# EAGLE design 2mbsimm_dip (EAGLE 8.0.1)
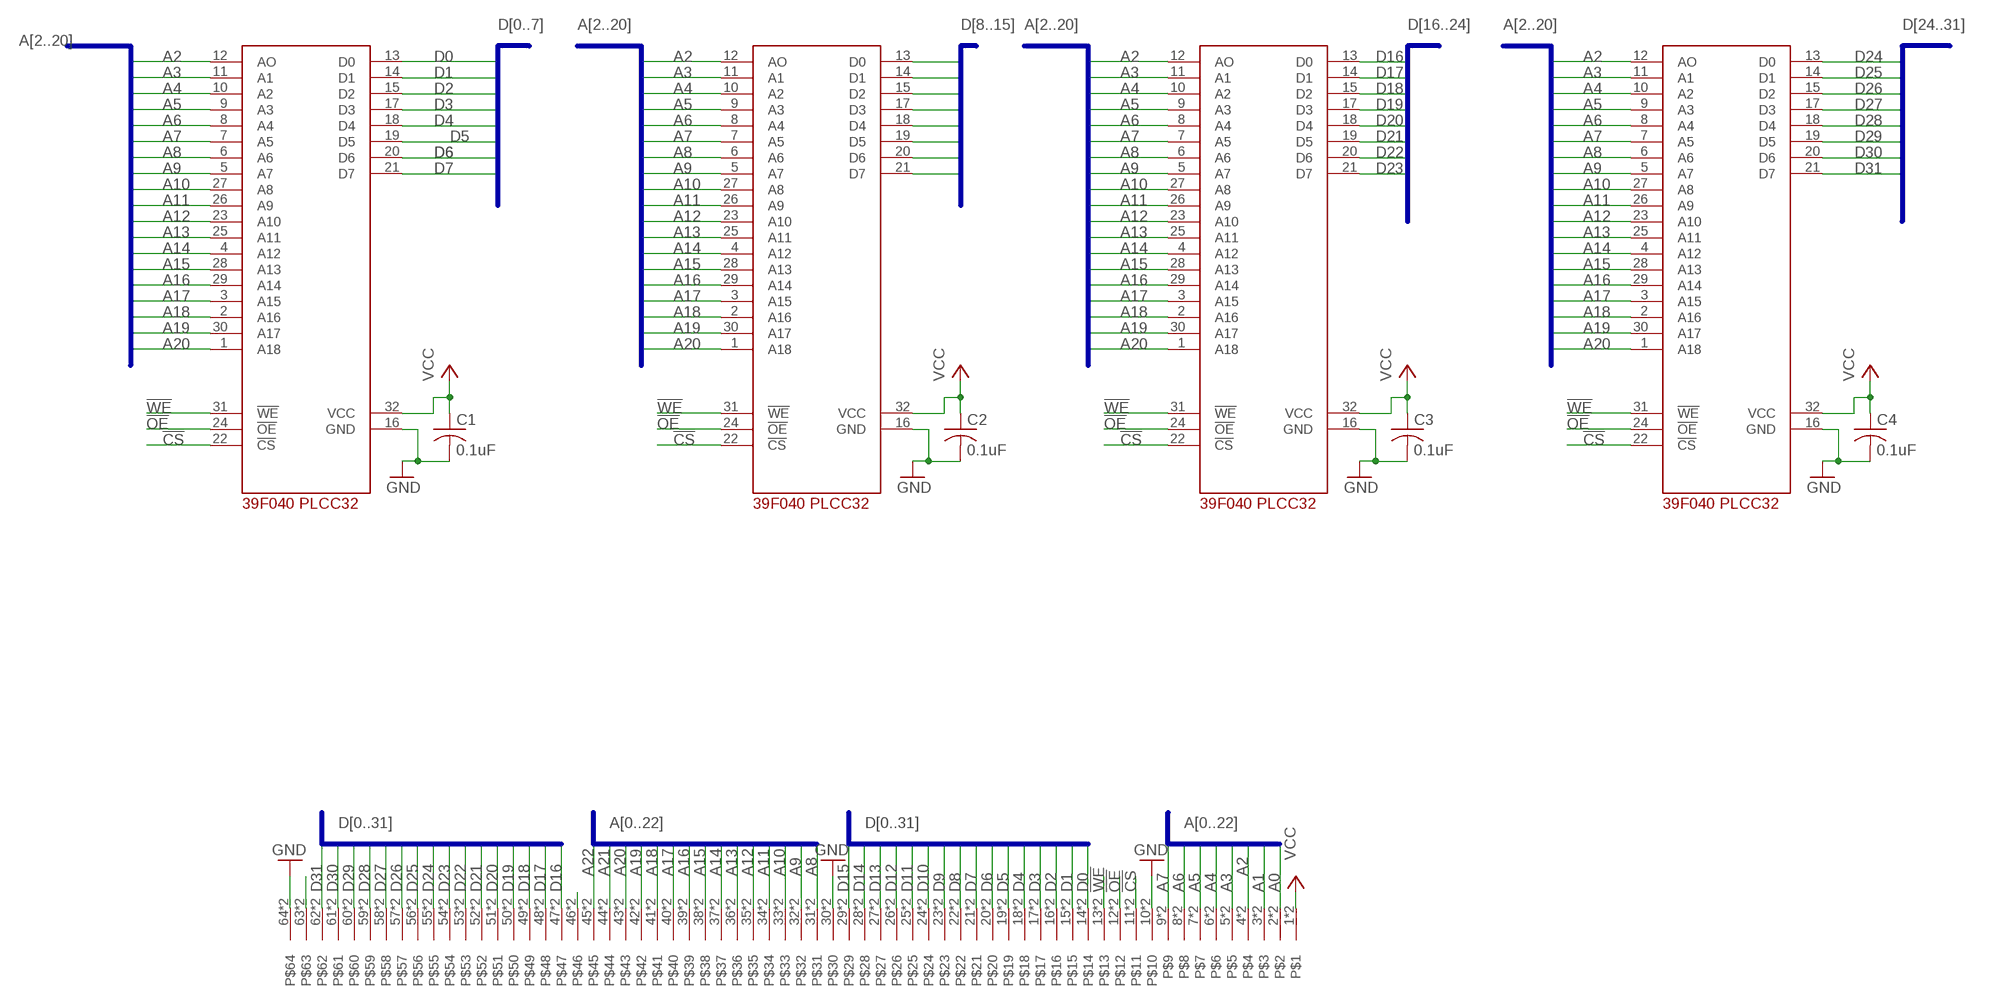
[diagram p0: schematic, sheet 1]

## Parts
C1  0.1uF  C-USC1206  [C1206]
C2  0.1uF  C-USC1206  [C1206]
C3  0.1uF  C-USC1206  [C1206]
C4  0.1uF  C-USC1206  [C1206]
CON1  MYSIMM  [SIMM64L]
U$1  39F040-PLCC-SOCKET-DIP  [S32]
U$2  39F040-PLCC-SOCKET-DIP  [S32]
U$3  39F040-PLCC-SOCKET-DIP  [S32]
U$4  39F040-PLCC-SOCKET-DIP  [S32]

## Nets
!CS: CON1.11 CON1.75 U$1.22(!CS) U$2.22(!CS) U$3.22(!CS) U$4.22(!CS)
!OE: CON1.12 CON1.76 U$1.24(!OE) U$2.24(!OE) U$3.24(!OE) U$4.24(!OE)
!WE: CON1.13 CON1.77 U$1.31(!WE) U$2.31(!WE) U$3.31(!WE) U$4.31(!WE)
A0: CON1.2 CON1.66
A1: CON1.3 CON1.67
A2: CON1.4 CON1.68 U$1.12(AO) U$2.12(AO) U$3.12(AO) U$4.12(AO)
A3: CON1.5 CON1.69 U$1.11(A1) U$2.11(A1) U$3.11(A1) U$4.11(A1)
A4: CON1.6 CON1.70 U$1.10(A2) U$2.10(A2) U$3.10(A2) U$4.10(A2)
A5: CON1.7 CON1.71 U$1.9(A3) U$2.9(A3) U$3.9(A3) U$4.9(A3)
A6: CON1.8 CON1.72 U$1.8(A4) U$2.8(A4) U$3.8(A4) U$4.8(A4)
A7: CON1.9 CON1.73 U$1.7(A5) U$2.7(A5) U$3.7(A5) U$4.7(A5)
A8: CON1.31 CON1.95 U$1.6(A6) U$2.6(A6) U$3.6(A6) U$4.6(A6)
A9: CON1.32 CON1.96 U$1.5(A7) U$2.5(A7) U$3.5(A7) U$4.5(A7)
A10: CON1.33 CON1.97 U$1.27(A8) U$2.27(A8) U$3.27(A8) U$4.27(A8)
A11: CON1.34 CON1.98 U$1.26(A9) U$2.26(A9) U$3.26(A9) U$4.26(A9)
A12: CON1.35 CON1.99 U$1.23(A10) U$2.23(A10) U$3.23(A10) U$4.23(A10)
A13: CON1.36 CON1.100 U$1.25(A11) U$2.25(A11) U$3.25(A11) U$4.25(A11)
A14: CON1.37 CON1.101 U$1.4(A12) U$2.4(A12) U$3.4(A12) U$4.4(A12)
A15: CON1.38 CON1.102 U$1.28(A13) U$2.28(A13) U$3.28(A13) U$4.28(A13)
A16: CON1.39 CON1.103 U$1.29(A14) U$2.29(A14) U$3.29(A14) U$4.29(A14)
A17: CON1.40 CON1.104 U$1.3(A15) U$2.3(A15) U$3.3(A15) U$4.3(A15)
A18: CON1.41 CON1.105 U$1.2(A16) U$2.2(A16) U$3.2(A16) U$4.2(A16)
A19: CON1.42 CON1.106 U$1.30(A17) U$2.30(A17) U$3.30(A17) U$4.30(A17)
A20: CON1.43 CON1.107 U$1.1(A18) U$2.1(A18) U$3.1(A18) U$4.1(A18)
A21: CON1.44 CON1.108
A22: CON1.45 CON1.109
D0: CON1.14 CON1.78 U$1.13(D0)
D1: CON1.15 CON1.79 U$1.14(D1)
D2: CON1.16 CON1.80 U$1.15(D2)
D3: CON1.17 CON1.81 U$1.17(D3)
D4: CON1.18 CON1.82 U$1.18(D4)
D5: CON1.19 CON1.83 U$1.19(D5)
D6: CON1.20 CON1.84 U$1.20(D6)
D7: CON1.21 CON1.85 U$1.21(D7)
D8: CON1.22 CON1.86 U$2.13(D0)
D9: CON1.23 CON1.87 U$2.14(D1)
D10: CON1.24 CON1.88 U$2.15(D2)
D11: CON1.25 CON1.89 U$2.17(D3)
D12: CON1.26 CON1.90 U$2.18(D4)
D13: CON1.27 CON1.91 U$2.19(D5)
D14: CON1.28 CON1.92 U$2.20(D6)
D15: CON1.29 CON1.93 U$2.21(D7)
D16: CON1.47 CON1.111 U$3.13(D0)
D17: CON1.48 CON1.112 U$3.14(D1)
D18: CON1.49 CON1.113 U$3.15(D2)
D19: CON1.50 CON1.114 U$3.17(D3)
D20: CON1.51 CON1.115 U$3.18(D4)
D21: CON1.52 CON1.116 U$3.19(D5)
D22: CON1.53 CON1.117 U$3.20(D6)
D23: CON1.54 CON1.118 U$3.21(D7)
D24: CON1.55 CON1.119 U$4.13(D0)
D25: CON1.56 CON1.120 U$4.14(D1)
D26: CON1.57 CON1.121 U$4.15(D2)
D27: CON1.58 CON1.122 U$4.17(D3)
D28: CON1.59 CON1.123 U$4.18(D4)
D29: CON1.60 CON1.124 U$4.19(D5)
D30: CON1.61 CON1.125 U$4.20(D6)
D31: CON1.62 CON1.126 U$4.21(D7)
GND [thicker]: C1.2 C2.2 C3.2 C4.2 CON1.10 CON1.30 CON1.64 CON1.74 CON1.94 CON1.128 U$1.16(GND) U$2.16(GND) U$3.16(GND) U$4.16(GND)
N$1 [thicker]: CON1.46 CON1.110
UNUSED3: CON1.63 CON1.127
VCC [thicker]: C1.1 C2.1 C3.1 C4.1 CON1.1 CON1.65 U$1.32(VCC) U$2.32(VCC) U$3.32(VCC) U$4.32(VCC)

## Buses
A[0..22]
D[0..31]
A[2..20]
D[0..7]
D[8..15]
D[16..24]
D[24..31]

## Library data of the parts
C1-C4 = resistor:C-US: CAPACITOR, American symbol
CON1 = Doug:MYSIMM: 64-Pin SIMM
U$1-U$4 = capstuff:39F040-PLCC-SOCKET-DIP: 4MB Flash in Plcc socket

## Net classes
0 default: width 0.178 mm, drill 0.305 mm, clearance 0.178 mm
1 thicker: width 0.305 mm, drill 0.305 mm, clearance 0.178 mm

## Board
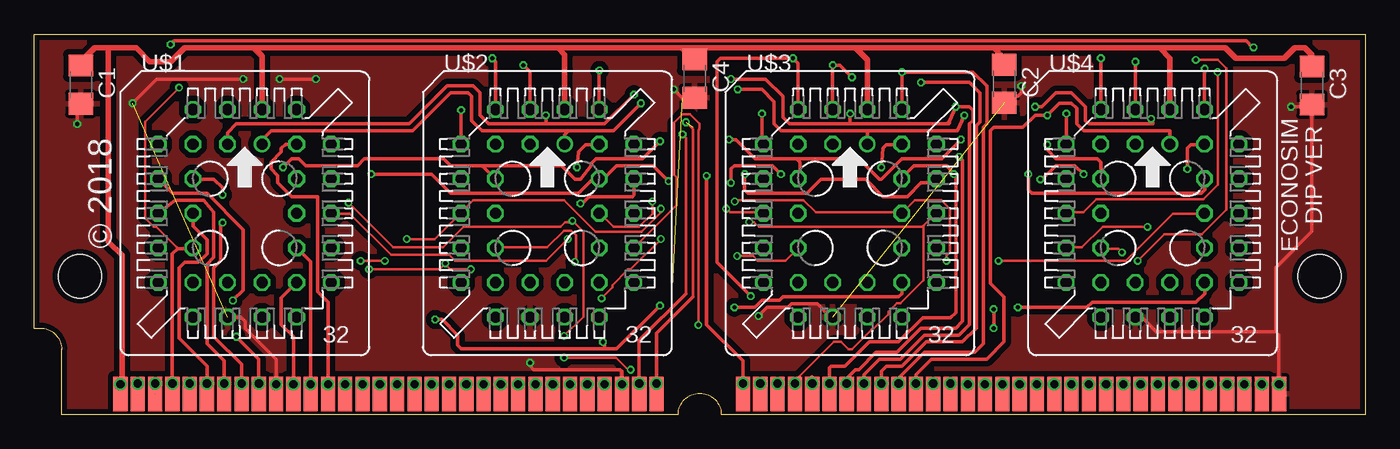
[diagram p1: board, top side]
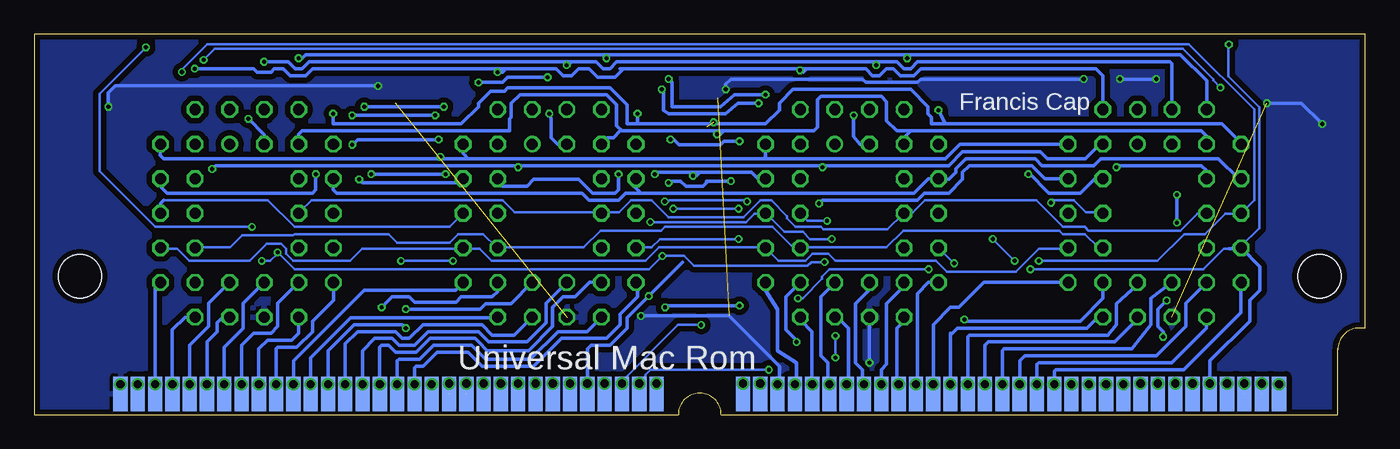
[diagram p2: board, bottom side, seen from below]

Size 97.79 x 27.94 mm. Coordinates in mm from the lower left corner, seen from the top.
Copper layers (1*16): Top 0.035559375mm / dielectric 1.6mm / Bottom 0.035559375mm
Design rules "oshpark-2layer": minimum track width 6mil, minimum drill 10mil, track to track 6mil, track to pad 6mil, pad to pad 6mil, via to via 6mil, smd to smd 6mil, copper to edge 15mil, drill to drill 6mil, minimum pad ring 5mil, minimum via ring 5mil, stop-mask expansion 2.5mil, vias tented up to drill 0mil, thermal gap 10mil

### Footprints (pad centres in the part's own frame; a part is rotated, then mirrored left to right if it is on the bottom)
C1206 = smd 1.6 x 1.8: 1 -1.4,0; 2 1.4,0
SIMM64L = smd 1.041 x 2.54: 1 -42.545,-8.636; 2 -41.275,-8.636; 3 -40.005,-8.636; 4 -38.735,-8.636; 5 -37.465,-8.636; 6 -36.195,-8.636; 7 -34.925,-8.636; 8 -33.655,-8.636; 9 -32.385,-8.636; 10 -31.115,-8.636; 11 -29.845,-8.636; 12 -28.575,-8.636; 13 -27.305,-8.636; 14 -26.035,-8.636; 15 -24.765,-8.636; 16 -23.495,-8.636; 17 -22.225,-8.636; 18 -20.955,-8.636; 19 -19.685,-8.636; 20 -18.415,-8.636; 21 -17.145,-8.636; 22 -15.875,-8.636; 23 -14.605,-8.636; 24 -13.335,-8.636; 25 -12.065,-8.636; 26 -10.795,-8.636; 27 -9.525,-8.636; 28 -8.255,-8.636; 29 -6.985,-8.636; 30 -5.715,-8.636; 31 -4.445,-8.636; 32 -3.175,-8.636; 33 3.175,-8.636; 34 4.445,-8.636; 35 5.715,-8.636; 36 6.985,-8.636; 37 8.255,-8.636; 38 9.525,-8.636; 39 10.795,-8.636; 40 12.065,-8.636; 41 13.335,-8.636; 42 14.605,-8.636; 43 15.875,-8.636; 44 17.145,-8.636; 45 18.415,-8.636; 46 19.685,-8.636; 47 20.955,-8.636; 48 22.225,-8.636; 49 23.495,-8.636; 50 24.765,-8.636; 51 26.035,-8.636; 52 27.305,-8.636; 53 28.575,-8.636; 54 29.845,-8.636; 55 31.115,-8.636; 56 32.385,-8.636; 57 33.655,-8.636; 58 34.925,-8.636; 59 36.195,-8.636; 60 37.465,-8.636; 61 38.735,-8.636; 62 40.005,-8.636; 63 41.275,-8.636; 64 42.545,-8.636 | smd 1.041 x 2.54 bottom: 65 -42.545,-8.636; 66 -41.275,-8.636; 67 -40.005,-8.636; 68 -38.735,-8.636; 69 -37.465,-8.636; 70 -36.195,-8.636; 71 -34.925,-8.636; 72 -33.655,-8.636; 73 -32.385,-8.636; 74 -31.115,-8.636; 75 -29.845,-8.636; 76 -28.575,-8.636; 77 -27.305,-8.636; 78 -26.035,-8.636; 79 -24.765,-8.636; 80 -23.495,-8.636; 81 -22.225,-8.636; 82 -20.955,-8.636; 83 -19.685,-8.636; 84 -18.415,-8.636; 85 -17.145,-8.636; 86 -15.875,-8.636; 87 -14.605,-8.636; 88 -13.335,-8.636; 89 -12.065,-8.636; 90 -10.795,-8.636; 91 -9.525,-8.636; 92 -8.255,-8.636; 93 -6.985,-8.636; 94 -5.715,-8.636; 95 -4.445,-8.636; 96 -3.175,-8.636; 97 3.175,-8.636; 98 4.445,-8.636; 99 5.715,-8.636; 100 6.985,-8.636; 101 8.255,-8.636; 102 9.525,-8.636; 103 10.795,-8.636; 104 12.065,-8.636; 105 13.335,-8.636; 106 14.605,-8.636; 107 15.875,-8.636; 108 17.145,-8.636; 109 18.415,-8.636; 110 19.685,-8.636; 111 20.955,-8.636; 112 22.225,-8.636; 113 23.495,-8.636; 114 24.765,-8.636; 115 26.035,-8.636; 116 27.305,-8.636; 117 28.575,-8.636; 118 29.845,-8.636; 119 31.115,-8.636; 120 32.385,-8.636; 121 33.655,-8.636; 122 34.925,-8.636; 123 36.195,-8.636; 124 37.465,-8.636; 125 38.735,-8.636; 126 40.005,-8.636; 127 41.275,-8.636; 128 42.545,-8.636 | hole 3.175: 45.517,0; -45.517,0
S32 = drill 0.813: 1 1.27,5.08 | drill 0.813 octagon: 2 -1.27,7.62; 3 -1.27,5.08; 4 -3.81,7.62; 5 -6.35,5.08; 6 -3.81,5.08; 7 -6.35,2.54; 8 -3.81,2.54; 9 -6.35,0; 10 -3.81,0; 11 -6.35,-2.54; 12 -3.81,-2.54; 13 -6.35,-5.08; 14 -3.81,-7.62; 15 -3.81,-5.08; 16 -1.27,-7.62; 17 -1.27,-5.08; 18 1.27,-7.62; 19 1.27,-5.08; 20 3.81,-7.62; 21 6.35,-5.08; 22 3.81,-5.08; 23 6.35,-2.54; 24 3.81,-2.54; 25 6.35,0; 26 3.81,0; 27 6.35,2.54; 28 3.81,2.54; 29 6.35,5.08; 30 3.81,7.62; 31 3.81,5.08; 32 1.27,7.62

### Placement (x,y rotation side)
C1  3.44,24.23 270 top
C2  71.25,24.29 270 top
C3  93.86,24.16 270 top
C4  48.52,24.67 270 top
CON1  48.9,10.16 0 top
U$1  15.48,14.78 0 top
U$2  37.7,14.78 0 top
U$3  59.93,14.78 0 top
U$4  82.15,14.78 0 top

### Tracks (layer width: path | path; a pad name or v marks a point on that pad's centre or on a via)
!CS  (via drill 0.3 pad 0.25, 0.6)
  Top 0.254: CON1.75 19.05,5.71 18.16,6.6 18.16,8.57 U$1.22 | v29.46,6.99 29.97,6.99 31.12,5.84 31.12,5.08 31.37,4.83 41.91,4.83 | 41.91,4.83 41.91,5.21 v41.78,5.33 | 41.91,4.83 42.8,4.83 v45.97,8 | v51.44,7.87 52.96,7.87 53.47,8.38 54.74,8.38 54.99,8.64 63.5,8.64 63.75,8.89 63.75,9.68 U$3.22 | v72.26,7.87 77.34,7.87 77.72,8.26 85.34,8.26 85.98,8.89 85.98,9.68 U$4.22
  Top 0.406: v19.05,2.22 CON1.75
  Bottom 0.254: U$1.22 19.29,8.53 20.96,6.86 29.34,6.86 v29.46,6.99 | v41.78,5.33 41.78,5.46 42.55,6.22 42.55,8.67 U$2.22 | v45.97,8 51.31,8 v51.44,7.87 | U$3.22 63.74,9.03 64.13,8.64 66.42,8.64 66.8,8.26 69.85,8.26 70.23,8.64 71.5,8.64 v72.26,7.87
  Bottom 0.305: v19.05,2.22 CON1.75
!OE  (via drill 0.6)
  Top 0.178: 20.16,2.38 v20.32,2.22
  Top 0.254: CON1.76 20.32,11.21 U$1.24
  Top 0.406: v20.32,2.22 CON1.76
  Bottom 0.178: v20.32,2.22 20.32,2.54 | U$1.24 19.37,12.27 19.63,12.27 20.61,13.25 22.21,13.25 22.48,13.51 33.95,13.51 35.19,12.27 41.5,12.27 U$2.24 41.59,12.27 42.04,12.27 43.55,13.78 51.46,13.78 51.73,13.51 56.17,13.51 57.42,12.27 63.73,12.27 U$3.24 63.82,12.27 64.8,13.25 66.66,13.25 67.28,12.62 71.11,12.62 71.73,13.25 78.66,13.25 78.75,13.16 82.49,13.16 83.38,12.27 85.95,12.27 U$4.24
  Bottom 0.305: v20.32,2.22 CON1.76
!WE  (via drill 0.3 pad 0.25, 0.6)
  Top 0.254: CON1.77 21.59,8.26 20.83,9.02 20.83,16 18.92,16 17.91,17.02 17.91,17.53 17.4,18.03 17.4,18.54 18.16,19.3 18.16,19.56 18.46,19.86 U$1.31 | v39.88,18.16 40.01,19.3 40.51,19.81 41.47,19.81 U$2.31 | v62.23,18.16 62.36,19.56 62.61,19.81 63.69,19.81 U$3.31 | v84.71,18.03 84.71,19.56 84.96,19.81 85.91,19.81 U$4.31
  Top 0.406: v21.59,2.22 CON1.77
  Bottom 0.254: v21.59,2.22 21.72,2.35 | U$1.31 19.51,19.86 20.57,18.8 23.37,18.8 23.88,19.3 29.59,19.3 30.61,18.29 39.75,18.29 | 39.75,18.29 v39.88,18.16 | 39.75,18.29 62.1,18.29 | 62.1,18.29 v62.23,18.16 | 62.1,18.29 84.46,18.29 v84.71,18.03
  Bottom 0.305: v21.59,2.22 CON1.77
A0  (1 unrouted)
A1  (1 unrouted)
A2  (via drill 0.3, 0.6 pad 0.25)
  Top 0.178: 11.63,12.19 11.63,12.18 U$1.12 | v39.73,11.2 39.82,11.29 39.82,13.16 39.46,13.51 38.93,13.51 37.68,12.27 33.95,12.27 U$2.12 | v51.64,11.65 52.79,11.65 53.15,11.29 55.19,11.29 56.08,12.18 U$3.12 | v79.91,11.91 79.64,12.18 78.4,12.18 U$4.12 | v10.66,24 8.17,21.51 8.17,14.4 8.79,13.78 8.97,13.78 10.48,12.27 10.54,12.19 | v85.33,26.05 86.93,26.05 87.55,25.43 87.55,15.02 85.78,13.25 83.02,13.25 v81.06,11.29
  Top 0.254: v10.16,2.29 CON1.4 10.16,11.81 10.54,12.19 11.63,12.19 11.81,12.19
  Bottom 0.178: CON1.4 10.21,1.6 10.21,2.22 v10.16,2.29 | v39.73,11.2 40.7,11.2 40.97,10.94 49.33,10.94 50.04,11.65 v51.64,11.65 52.62,10.67 78.66,10.67 v79.91,11.91 79.91,11.82 80.44,11.29 v81.06,11.29 | v10.66,24 11.19,24.54 11.19,24.62 13.41,26.85 84.53,26.85 v85.33,26.05
A3  (via drill 0.3, 0.3 pad 0.25, 0.6 pad 0.25)
  Top 0.178: v24.61,10.67 29.77,10.67 v30.21,11.11 30.21,11.02 30.57,10.67 v32.08,10.67 | v46.04,12.89 43.82,10.67 43.64,10.67 42.48,9.51 42.48,9.34 v41.68,8.53 | v81.78,13.78 78.49,13.78 76.97,12.27 75.82,12.27 U$4.11
  Top 0.254: CON1.69 v11.43,2.29 | v89.57,26.96 89.5,26.96 89.03,27.43 10.29,27.43 v10.03,27.18
  Bottom 0.178: v11.43,2.29 11.46,2.31 CON1.69 | v24.61,10.67 11.9,10.67 10.39,12.18 10.12,12.18 10.03,12.19 | v30.21,11.11 31.28,12.18 U$2.11 | v46.04,12.89 51.82,12.89 52.44,12.27 53.51,12.27 U$3.11 | v41.68,8.53 41.33,8.53 39.9,9.96 39.9,10.13 39.37,10.67 v32.08,10.67 | v81.78,13.78 88.89,13.78 92.98,17.87 92.98,23.56 89.7,26.84 | U$1.11 9.14,12.36 7.81,13.69 7.81,22.58 10.08,24.85 10.08,27.13 v10.03,27.18
  Bottom 0.254: CON1.69 v11.43,2.29 11.43,3.94 8.51,6.86 8.51,8.38 7.75,9.14 7.75,10.86 U$1.11 9.73,12.24 9.78,12.19 10.03,12.19 | 89.7,26.84 v89.57,26.96
A4  (via drill 0.6 pad 0.25)
  Top 0.254: v12.7,2.29 CON1.70 12.7,3.56 10.67,5.59 10.67,10.79 11.05,11.18 12.07,11.18 12.7,11.81 12.7,12.83 11.68,13.84 11.68,14.76 U$1.10
  Bottom 0.178: U$4.10 78.31,14.85 77.42,15.73 63.37,15.73 62.48,14.85 56.17,14.85 U$3.10 56.08,14.85 54.84,14.85 53.95,15.73 52.44,15.73 51.19,14.49 45.68,14.49 44.44,15.73 43.64,15.73 42.48,14.58 42.48,14.4 41.86,13.78 39.99,13.78 39.82,13.6 35.1,13.6 33.95,14.76 U$2.10 33.86,14.85 33.24,14.85 32.35,15.73 24.17,15.73 22.21,13.78 20.61,13.78 20.35,13.51 13.59,13.51 12.34,14.76 11.72,14.76 U$1.10 | v12.7,2.29 CON1.70
A5  (via drill 0.3, 0.6 pad 0.25)
  Top 0.178: v13.97,2.29 14.03,2.31 CON1.71 | v25.77,11.29 v23.99,11.29 | v27.37,12.89 29.41,12.89 31.28,14.76 U$2.9 31.37,14.85 32.26,15.73 38.93,15.73 41.24,13.42 44.62,13.42 46.04,14.85 v46.04,15.11 | v50.84,15.11 51.11,14.85 53.51,14.85 U$3.9 | v86.93,25.16 86.93,16.89 85.87,15.82 78.04,15.82 77.06,14.85 75.82,14.85 U$4.9
  Top 0.254: U$1.9 10.35,15.75 12.45,15.75 13.21,14.86 13.21,11.56 12.7,11.05 12.7,5.21 13.97,3.94 v13.97,2.29 CON1.71
  Bottom 0.178: v23.99,11.29 15.28,11.29 13.32,13.25 11.81,13.25 10.3,14.76 9.14,14.76 U$1.9 9.06,14.85 8.17,15.73 8.17,22.4 12.97,27.2 85.06,27.2 86.93,25.34 v86.93,25.16 | v27.37,12.89 v25.77,11.29 | v46.04,15.11 v50.84,15.11
  Bottom 0.254: v13.97,2.29 CON1.71
A6  (via drill 0.3 pad 0.25, 0.6 pad 0.25)
  Top 0.178: v15.24,2.29 15.28,2.31 CON1.72
  Top 0.254: CON1.72 v15.24,2.29 15.24,3.68 13.21,5.71 13.21,10.79 13.72,11.3 13.72,13.97 v13.84,14.1 | v13.84,16.13 13.84,16.64 13.21,17.27 11.72,17.27 U$1.8 | v18.29,18.16 18.92,18.8 19.43,18.8 19.94,18.29 23.75,18.29 24.26,18.8 30.1,18.8 30.61,18.29 32.93,18.29 | 32.93,18.29 U$2.8 | 32.93,18.29 38.73,18.29 39.75,17.27 40.13,17.27 40.89,18.29 40.89,18.41 41.27,18.8 44.7,18.8 v45.97,20.07 | v51.05,20.19 51.56,20.19 52.96,18.8 56.01,18.8 | 56.01,18.8 56.26,18.54 56.26,17.46 U$3.8 | 56.01,18.8 60.58,18.8 62.1,17.27 62.23,17.27 63.75,18.8 66.68,18.8 v68.07,20.19 | v74.42,19.81 74.42,19.43 75.06,18.8 78.1,18.8 78.36,18.54 78.36,17.34 U$4.8
  Bottom 0.254: v15.24,2.29 CON1.72 | v13.84,14.1 v13.84,16.13 | U$1.8 11.67,17.89 12.07,18.29 18.16,18.29 v18.29,18.16 | v45.97,20.07 47.12,20.07 47.37,19.81 50.42,19.81 50.93,20.32 v51.05,20.19 | v68.07,20.19 74.04,20.19 v74.42,19.81
A7  (via drill 0.3 pad 0.25, 0.6 pad 0.25)
  Top 0.178: v16.51,2.29 16.52,2.31 CON1.73
  Top 0.254: CON1.73 v16.51,2.29 16.51,4.06 v14.86,5.71 | v14.61,8.38 15.37,9.14 15.37,13.59 12.7,16.26 10.19,16.26 U$1.7
  Bottom 0.254: CON1.73 v16.51,2.29 | v14.86,5.71 14.86,6.1 15.24,6.48 15.24,7.75 v14.61,8.38 | U$1.7 9.32,17.32 10.8,18.8 19.43,18.8 19.94,18.29 23.75,18.29 24.26,18.8 29.34,18.8 30.1,18.03 30.1,17.78 30.61,17.27 31.31,17.27 U$2.7 32.08,17.32 33.15,16.26 53.21,16.26 | 53.21,16.26 53.72,16.76 53.72,17.18 U$3.7 | 53.21,16.26 54.36,16.26 54.86,15.75 57.02,15.75 57.53,16.26 75.56,16.26 75.82,16.51 75.82,17.3 U$4.7
A8  (via drill 0.3 pad 0.25, 0.6 pad 0.25)
  Top 0.178: 47.88,8.89 47.88,20.32 v47.62,20.57
  Top 0.254: v44.45,2.29 CON1.31 44.45,5.46 47.88,8.89
  Bottom 0.178: CON1.31 44.44,1.6 44.44,2.22 v44.45,2.29
  Bottom 0.254: U$1.6 11.67,20.43 12.07,20.83 33.4,20.83 | 47.12,20.83 54.61,20.83 | 47.12,20.83 40.51,20.83 40.26,21.08 40.26,23.11 40.01,23.37 35.56,23.37 35.18,22.99 35.18,21.59 34.42,20.83 33.4,20.83 | U$2.6 33.89,20.34 33.4,20.83 | v47.62,20.57 47.37,20.57 47.12,20.83 | U$4.6 78.36,19.88 78.36,20.57 78.1,20.83 62.87,20.83 62.87,21.72 62.74,21.84 62.74,22.86 62.1,23.5 55.75,23.5 54.99,22.73 54.99,21.21 54.61,20.83 | 54.61,20.83 54.74,20.83 55.25,20.32 55.66,20.32 U$3.6
A9  (via drill 0.3 pad 0.25, 0.6 pad 0.25)  (1 unrouted)
  Top 0.178: 48.39,8.64 48.39,20.95 v47.88,21.46
  Top 0.254: v45.72,2.29 CON1.96 45.72,5.97 48.39,8.64 | v31.37,22.35 31.37,19.88 U$2.5 | v53.47,22.1 53.47,19.97 U$3.5 | v75.82,22.1 75.82,19.88 U$4.5
  Bottom 0.178: CON1.96 45.77,1.6 45.77,2.22 v45.72,2.29
  Bottom 0.254: U$1.5 9.13,19.92 10.54,21.34 30.86,21.34 | 47.88,21.34 44.07,21.34 43.05,22.35 43.05,22.86 42.04,23.88 33.4,23.88 32.13,22.61 32.13,22.1 31.88,21.84 31.88,21.34 30.86,21.34 | 47.88,21.34 53.47,21.34 | 53.47,21.34 54.23,21.34 54.23,22.73 55.5,24 62.99,24 63.25,23.75 64.26,23.75 65.15,22.86 65.15,22.61 66.42,21.34 75.82,21.34 v75.82,22.1 | 75.82,19.88 U$4.5 | 30.86,21.34 v31.37,22.35 | 53.47,21.34 v53.47,22.1 | v47.88,21.46 47.88,21.34
A10  (via drill 0.3 pad 0.25, 0.6 pad 0.25)
  Top 0.254: v52.07,2.29 CON1.97 52.07,3.94 49.4,6.6 v49.4,17.53 | v40.13,15.49 40.26,15.49 40.77,16 43.94,16 44.07,16.13 44.07,17.21 44.01,17.27 U$2.27 | v52.2,17.65 52.2,16.51 52.45,16.26 56.77,16.26 57.79,17.27 61.09,17.27 62.36,16 64.13,16 65.15,17.02 65.98,17.02 U$3.27 | v73.91,17.27 74.04,17.27 75.06,18.29 76.45,18.29 v77.09,17.65
  Bottom 0.178: CON1.97 52.08,1.6 52.08,2.22 v52.07,2.29
  Bottom 0.254: U$1.27 23.54,17.32 24.51,18.29 29.08,18.29 29.59,17.78 29.59,17.27 30.61,16.26 32.39,16.26 32.89,15.75 39.88,15.75 v40.13,15.49 | U$2.27 44.62,17.32 45.09,17.78 48.9,17.78 | 48.9,17.78 52.07,17.78 v52.2,17.65 | 73.87,17.32 v73.91,17.27 73.66,17.02 66.68,17.02 66.37,17.32 U$3.27 | v77.09,17.65 77.09,16.51 77.34,16.26 88.01,16.26 88.52,16.76 88.52,17.3 U$4.27 | v49.4,17.53 49.15,17.53 48.9,17.78
A11  (via drill 0.3, 0.6 pad 0.25)
  Top 0.178: v53.34,2.29 53.42,2.22 53.42,1.6 CON1.98 | v43.82,3.29 43.64,3.29 42.75,4.18 v38.93,4.18 | v38.93,5.78 40.35,7.2 40.35,13.42 v39.55,14.22 39.55,14.13 39.01,14.13 38.66,13.78 31.55,13.78 30.04,12.27 26.39,12.27 v23.1,15.56 | v51.46,15.65 51.55,15.73 56.53,15.73 57.42,14.85 63.73,14.85 U$3.26 63.82,14.85 64.71,15.73 66.66,15.73 67.28,15.11 67.28,11.91 67.02,11.65 v67.02,11.29 | v45.41,15.65 45.41,14.76 44.44,13.78 42.57,13.78 41.59,14.76 U$2.26 | v70.84,11.29 80.18,11.29 83.64,14.76 85.95,14.76 U$4.26
  Bottom 0.178: v43.82,3.29 52.53,3.29 52.88,2.93 52.88,2.85 53.33,2.4 CON1.98 | v38.93,5.78 v38.93,4.18 | v39.55,14.22 40.97,14.22 41.5,14.76 U$2.26 | v23.1,15.56 22.92,15.73 21.41,15.73 20.52,14.85 19.37,14.85 U$1.26 | v51.46,15.65 51.19,15.65 51.11,15.73 45.5,15.73 v45.41,15.65 | v67.02,11.29 v70.84,11.29
  Bottom 0.254: CON1.98 v53.34,2.29
A12  (via drill 0.3, 0.6 pad 0.25)
  Top 0.178: v48.79,6.58 48.79,20.89 48.88,20.98 48.88,21.34 48.17,22.05 47.64,22.05 47.02,21.43 47.02,17.6 47.19,17.42 47.19,15.38 U$2.23
  Top 0.254: v54.61,2.29 CON1.99
  Bottom 0.178: CON1.99 54.66,1.6 54.66,2.22 v54.61,2.29 54.57,2.31 54.57,2.49 50.48,6.58 v48.79,6.58 | U$1.23 21.86,12.18 23.99,12.18 25.68,10.49 30.75,10.49 31.55,11.29 38.93,11.29 39.46,11.82 40.62,11.82 41.15,11.29 43.1,11.29 U$2.23 44.08,12.27 51.91,12.27 52.88,11.29 64.17,11.29 65.06,12.18 66.22,12.18 U$3.23 66.31,12.18 73.69,12.18 74.57,11.29 78.75,11.29 79.29,11.82 79.29,12.18 79.64,12.54 80.71,12.54 81.95,11.29 86.4,11.29 87.29,12.18 88.44,12.18 U$4.23
A13  (via drill 0.3, 0.6 pad 0.25)
  Top 0.178: v39.19,12.89 37.59,11.29 30.92,11.29 30.48,11.73 26.21,11.73 23.19,14.76 21.86,14.76 U$1.25 | CON1.36 55.91,1.6 55.91,2.22 v55.88,2.29 55.91,2.31 55.91,2.49 58.75,5.33 59.28,5.33 59.82,4.8 60.08,4.8 61.51,6.22 61.59,6.22 62.75,7.38 62.75,7.56 63.37,8.18 63.64,8.18 65.33,9.87 65.33,13.78 | 65.33,13.78 65.33,13.87 66.22,14.76 U$3.25 | v52.53,14.13 52.88,14.13 53.24,13.78 65.33,13.78
  Bottom 0.178: v39.19,12.89 40.79,12.89 41.33,13.42 42.66,13.42 43.99,14.76 U$2.25 44.08,14.76 44.88,14.76 45.5,14.13 v52.53,14.13 | 88.27,15.75 88.18,15.73 80.62,15.73 78.66,13.78 67.28,13.78 66.31,14.76 U$3.25
  Bottom 0.254: CON1.36 v55.88,2.29 | U$4.25 88.5,15.51 88.27,15.75
A14  (via drill 0.3 pad 0.25, 0.6 pad 0.25)
  Top 0.254: v57.15,2.29 CON1.37 57.15,2.79 | U$4.4 78.34,26.15 v78.36,26.16 | U$2.4 33.89,25.92 v33.66,26.16 | U$3.4 56.12,25.8 v55.75,26.16 50.42,26.16 50.16,25.91 50.16,11.18 v52.64,8.7
  Bottom 0.178: v57.15,2.29 CON1.37
  Bottom 0.254: U$1.4 11.67,24.5 13.59,26.42 33.4,26.42 | 78.36,22.42 U$4.4 | 55.5,26.42 33.4,26.42 | 55.5,26.42 77.85,26.42 78.1,26.16 v78.36,26.16 | v33.66,26.16 33.4,26.42 | v55.75,26.16 55.5,26.42 | v57.15,2.29 57.15,4.83 56.9,5.08 55.5,5.08 54.23,6.35 54.23,7.11 v52.64,8.7 50.16,11.18
A15  (via drill 0.3 pad 0.25, 0.6 pad 0.25)
  Top 0.178: v58.42,2.29 58.48,2.31 CON1.38
  Top 0.254: 58.42,2.54 v58.42,2.29 | v24.77,17.65 29.21,17.65 30.61,16.26 40.01,16.26 41.02,17.27 41.47,17.27 U$2.28 41.83,17.32 42.8,18.29 45.47,18.29 v46.61,17.14 | v51.18,17.02 51.18,18.03 51.44,18.29 54.23,18.29 v54.86,17.65 | U$3.28 63.74,17.38 64.64,18.29 67.06,18.29 v67.56,17.65 67.69,17.53 67.69,7.49 67.31,7.11 65.28,7.11 63.5,5.33 61.34,5.33 59.56,3.56 58.55,3.56 58.42,3.43 v58.42,2.29 | v73.03,17.65 73.03,16.51 73.28,16.26 85.72,16.26 85.98,16.51 85.98,17.34 | 85.98,17.53 85.98,17.34 | 85.98,17.34 U$4.28 | v58.42,2.29 58.42,2.41 | CON1.38 v58.42,2.29
  Bottom 0.178: U$3.28 63.82,17.34 63.88,17.27
  Bottom 0.254: CON1.38 v58.42,2.29 | U$1.28 19.89,17.32 20.96,16.26 23.24,16.26 24.77,17.78 v24.77,17.65 | v46.61,17.14 48.39,17.14 48.39,17.02 48.64,16.76 49.91,16.76 50.29,17.14 51.05,17.14 v51.18,17.02 | v54.86,17.65 54.86,16.51 55.12,16.26 56.77,16.26 57.79,17.27 61.09,17.27 61.59,16.76 63.37,16.76 63.88,17.27 | 72.9,17.78 v73.03,17.65 v67.56,17.65
A16  (via drill 0.3 pad 0.25, 0.6 pad 0.25)
  Top 0.178: v59.69,2.29 59.73,2.31 CON1.39
  Top 0.254: CON1.39 v59.69,2.29 59.69,2.67 60.33,3.3 60.58,3.3 61.85,4.57 63.37,4.57 65.15,6.35 67.69,6.35 68.2,6.86 68.2,18.67 v67.94,18.92
  Bottom 0.178: 44.17,18.8 44.17,18.85 44.07,18.8
  Bottom 0.254: v59.69,2.29 CON1.39 | U$1.29 29.8,19.86 30.86,18.8 43.56,18.8 44.07,18.8 | U$2.29 44.07,19.84 44.07,18.8 | 44.07,18.8 44.17,18.8 65.91,18.8 | 65.91,18.8 66.29,19.18 66.29,19.84 U$3.29 | U$4.29 88.52,19.84 88.52,19.05 88.27,18.8 67.69,18.8 | 67.69,18.8 65.91,18.8 | v67.94,18.92 67.94,19.05 67.69,18.8
A17  (via drill 0.3 pad 0.25, 0.6 pad 0.25)
  Top 0.178: v60.96,2.29 60.97,2.31 CON1.104
  Top 0.254: U$1.3 14.21,20.68 14.86,21.34 27.56,21.34 30.35,24.13 32.26,24.13 32.77,23.62 32.77,21.97 33.4,21.34 37.72,21.34 | 37.72,21.34 41.91,21.34 v44.07,23.5 | v51.18,24.64 53.72,24.64 54.99,23.37 54.99,21.84 55.5,21.34 60.07,21.34 | 60.07,21.34 67.18,21.34 67.25,21.4 67.25,21.53 | 82.17,21.34 77.47,21.34 77.22,21.59 77.22,22.61 76.2,23.62 75.06,23.62 74.04,22.61 v73.53,22.61 | 66.93,21.34 67.06,21.34 67.25,21.53 | 67.25,21.53 v67.69,22.61 68.71,22.61 68.96,22.35 68.96,21.59 68.71,21.34 68.71,6.6 67.94,5.84 65.41,5.84 63.63,4.06 62.1,4.06 60.96,2.92 v60.96,2.29 CON1.104 | 82.04,21.59 v82.04,21.72 | 82.04,21.59 82.04,21.46 82.17,21.34 | 82.17,21.34 82.17,21.46 82.04,21.59 | v59.94,22.1 59.94,21.46 60.07,21.34 | v37.59,21.97 37.59,21.46 37.72,21.34
  Bottom 0.254: v60.96,2.29 CON1.104 | v44.07,23.5 46.36,23.5 47.37,22.61 50.93,22.61 50.93,24.38 v51.18,24.64 | v67.69,22.61 v73.53,22.61 | U$4.3 80.88,20.56 v82.04,21.72 | U$3.3 59.36,19.86 59.82,20.32 59.82,21.72 v59.94,22.1 | U$2.3 37.13,19.86 37.59,20.45 v37.59,21.97
A18  (via drill 0.3 pad 0.25, 0.6 pad 0.25)
  Top 0.178: 62.3,2.23 62.31,2.22 CON1.41 62.22,2.31 v62.23,2.29
  Top 0.254: U$4.2 80.88,25.89 v80.9,25.91 | U$2.2 36.43,25.16 v35.94,25.65 | U$3.2 58.66,25.64 v58.67,25.65 59.18,25.65 v60.07,24.77 | v65.15,24.38 68.71,24.38 69.47,23.62 69.47,21.46 69.22,21.21 69.22,6.35 68.2,5.33 65.53,5.33 63.75,3.56 62.61,3.56 62.23,3.17 v62.23,2.29 CON1.41 | 62.36,2.29 62.3,2.23 62.1,2.03
  Bottom 0.254: v62.23,2.29 CON1.41 | U$1.2 14.21,25.77 14.35,25.91 32.89,25.91 33.4,25.4 33.91,25.4 34.42,25.91 35.69,25.91 | 35.69,25.91 54.99,25.91 55.5,25.4 56.01,25.4 56.52,25.91 58.29,25.91 | 58.29,25.91 77.6,25.91 78.1,25.4 78.61,25.4 79.12,25.91 v80.9,25.91 | v35.94,25.65 35.69,25.91 | v58.67,25.65 58.55,25.65 58.29,25.91 | v60.07,24.77 62.99,24.77 63.37,24.38 v65.15,24.38
A19  (via drill 0.3 pad 0.25, 0.6 pad 0.25)
  Top 0.178: v63.5,2.29 63.55,2.31 CON1.42
  Top 0.254: U$4.30 85.96,25.38 v85.98,25.4 | U$2.30 41.51,25.13 v41.53,25.27 | U$3.30 63.74,25.13 v63.75,25.15 68.96,25.15 69.98,24.13 69.98,21.34 69.72,21.08 69.72,5.21 69.09,4.57 65.41,4.57 63.5,2.67 v63.5,2.29 CON1.42
  Bottom 0.254: v63.5,2.29 CON1.42 63.5,2.54 | U$1.30 19.29,24.88 19.81,25.4 32.64,25.4 33.15,24.89 34.16,24.89 34.67,25.4 35.18,25.4 35.69,24.89 36.2,24.89 36.7,25.4 41.02,25.4 | 41.02,25.4 41.27,25.4 | 41.27,25.4 54.48,25.4 | 54.48,25.4 54.74,25.4 | 63.12,25.4 59.44,25.4 58.93,24.89 58.29,24.89 57.79,25.4 57.02,25.4 56.39,24.77 55.12,24.77 54.48,25.4 | 63.12,25.4 77.34,25.4 77.85,24.89 78.99,24.89 79.5,25.4 80.14,25.4 80.39,25.15 81.41,25.15 81.66,25.4 v85.98,25.4 | 41.27,25.4 v41.53,25.27 41.27,25.15 41.02,25.4 | v63.75,25.15 63.37,25.15 63.12,25.4
A20  (via drill 0.3 pad 0.25, 0.6 pad 0.25)
  Top 0.178: v64.77,2.29 64.8,2.31 CON1.107
  Top 0.254: U$1.1 16.75,20.18 17.4,20.83 27.81,20.83 30.61,23.62 31.88,23.62 32.13,23.37 32.13,21.59 32.89,20.83 39.24,20.83 | 39.24,20.83 42.55,20.83 v44.58,22.86 | v51.69,23.88 53.47,23.88 54.36,22.99 54.36,21.34 54.86,20.83 61.09,20.83 | 61.09,20.83 67.82,20.83 v68.33,21.97 | U$4.1 83.44,19.88 83.44,20.83 77.09,20.83 76.58,21.34 76.58,22.48 76.2,22.86 75.31,22.86 v74.42,21.97 73.53,21.97 72.64,21.08 70.49,21.08 70.23,20.83 70.23,9.65 71.25,8.64 71.25,5.33 69.98,4.06 65.91,4.06 64.77,2.92 v64.77,2.29 CON1.107 | U$3.1 61.2,20.72 61.09,20.83 | U$2.1 38.97,20.56 39.24,20.83
  Bottom 0.254: v64.77,2.29 CON1.107 | v44.58,22.86 46.1,22.86 46.99,22.1 51.18,22.1 51.56,22.35 51.56,23.75 v51.69,23.88 | v68.33,21.97 v74.42,21.97
A21  (1 unrouted)
A22  (1 unrouted)
D0  (via drill 0.6)
  Top 0.406: CON1.78 v22.86,2.22
  Bottom 0.178: CON1.78 22.92,1.6 22.92,2.13 v22.86,2.22 | 9.14,9.69 U$1.13
  Bottom 0.254: v22.86,2.22 22.86,3.17 22.73,3.3 13.34,3.3 9.14,7.49 9.14,9.69 9.14,9.78 9.02,9.91
D1  (via drill 0.6)
  Top 0.406: v24.13,2.22 CON1.79
  Bottom 0.178: CON1.79 24.17,1.6 24.17,2.13 v24.13,2.22 | 11.68,7.25 11.63,7.2 U$1.14
  Bottom 0.254: v24.13,2.22 24.13,3.68 24,3.81 14.22,3.81 11.68,6.35 11.68,7.24 11.68,7.25 11.56,7.37
D2  (via drill 0.6)
  Top 0.178: v25.4,2.22 25.4,2.46
  Top 0.406: v25.4,2.22 CON1.80
  Bottom 0.178: CON1.80 25.41,1.6 25.41,2.13 v25.4,2.22
  Bottom 0.254: v25.4,2.22 25.4,3.94 25.02,4.32 15.37,4.32 13.21,6.48 13.21,8.16 U$1.15
D3  (via drill 0.6)
  Top 0.406: v26.67,2.22 CON1.81
  Bottom 0.178: CON1.81 26.66,1.6 26.66,2.13 v26.67,2.22
  Bottom 0.254: v26.67,2.22 26.67,4.7 26.54,4.83 17.15,4.83 15.75,6.6 15.75,8.54 U$1.17
D4  (via drill 0.6)
  Top 0.406: v27.94,2.22 CON1.82
  Bottom 0.178: CON1.82 27.99,1.6 27.99,2.13 v27.94,2.22
  Bottom 0.254: U$1.18 16.75,7 18.42,5.33 27.69,5.33 27.94,5.08 v27.94,2.22
D5  (via drill 0.6)
  Top 0.406: v29.21,2.22 CON1.83
  Bottom 0.178: CON1.83 29.24,1.6 29.24,2.13 v29.21,2.22
  Bottom 0.254: U$1.19 16.75,9.54 18.29,8.13 18.29,6.6 18.92,5.84 29.08,5.84 29.21,5.71 v29.21,2.22
D6  (via drill 0.6)
  Top 0.406: v30.48,2.22 CON1.84
  Bottom 0.178: v30.48,2.22 CON1.84
  Bottom 0.254: 30.48,5.84 30.48,5.97 | 30.48,5.84 v30.48,2.22 30.48,2.03 | U$1.20 19.64,7.16 20.45,6.35 29.97,6.35 30.48,5.84
D7  (via drill 0.6)
  Top 0.406: v31.75,2.22 CON1.85
  Bottom 0.178: CON1.85 31.81,2.22 v31.75,2.22
  Bottom 0.254: U$1.21 28.02,9.7 29.85,7.87 30.48,7.87 31.75,6.6 v31.75,2.22 31.75,2.03
D8  (via drill 0.6)
  Top 0.406: v33.02,2.22 CON1.86
  Bottom 0.178: CON1.86 33.06,2.22 33.13,2.3
  Bottom 0.254: U$2.13 32.08,9.7 32.89,8.89 32.89,2.54 33.13,2.3 33.15,2.29
  Bottom 0.305: CON1.86 v33.02,2.22
D9  (via drill 0.6)
  Top 0.254: 34.42,2.35 v34.29,2.22
  Top 0.406: v34.29,2.22 CON1.87
  Bottom 0.254: U$2.14 33.89,6.87 34.42,6.35 34.42,2.35 v34.29,2.22
  Bottom 0.305: v34.29,2.22 CON1.87
D10  (via drill 0.6)
  Top 0.406: v35.56,2.22 CON1.88
  Bottom 0.254: U$2.15 33.89,9.41 35.18,8.13 35.18,3.68 35.56,3.3 v35.56,2.22
  Bottom 0.305: v35.56,2.22 CON1.88
D11  (via drill 0.6)
  Top 0.406: v36.83,2.22 CON1.89
  Bottom 0.254: U$2.17 36.43,9.16 37.47,8.13 37.47,3.81 36.96,3.3 36.96,2.35 v36.83,2.22
  Bottom 0.305: v36.83,2.22 CON1.89
D12  (via drill 0.6)
  Top 0.406: v38.1,2.22 CON1.90
  Bottom 0.254: U$2.18 38.78,7.16 37.97,6.35 37.97,2.35 v38.1,2.22
  Bottom 0.305: v38.1,2.22 CON1.90
D13  (via drill 0.6)
  Top 0.178: v39.37,2.22 39.37,2.66
  Top 0.406: v39.37,2.22 CON1.91
  Bottom 0.254: U$2.19 38.97,9.67 40.01,8.64 40.01,4.32 39.5,3.81 39.5,2.35 v39.37,2.22
  Bottom 0.305: v39.37,2.22 CON1.91
D14  (via drill 0.6)
  Top 0.406: v40.64,2.22 CON1.92
  Bottom 0.254: U$2.20 41.51,6.97 40.64,6.1 40.64,2.03
  Bottom 0.305: CON1.92 40.64,2.03 v40.64,2.22
D15  (via drill 0.6)
  Top 0.406: v41.91,2.22 CON1.93
  Bottom 0.254: U$2.21 44.05,9.13 43.18,7.75 43.18,4.7 41.78,3.81 41.78,2.16 41.91,2.03
  Bottom 0.305: CON1.93 41.91,2.03 v41.91,2.22
D16  (via drill 0.6)
  Top 0.178: v69.85,2.22 69.85,2.7
  Top 0.406: CON1.111 v69.85,2.22
  Bottom 0.254: v69.85,2.22 69.85,3.43 69.72,3.56 69.22,3.56 68.2,4.57 65.91,4.57 64.9,3.56 61.09,3.56 59.05,5.59 55.75,5.59 54.74,6.6 54.74,7.37 53.47,8.64 53.47,9.59 U$3.13
  Bottom 0.305: CON1.111 v69.85,2.22
D17  (via drill 0.6)
  Top 0.178: v71.12,2.22 71.12,2.62
  Top 0.406: v71.12,2.22 CON1.112
  Bottom 0.254: v71.12,2.22 71.12,3.94 70.99,4.06 69.47,4.06 68.45,5.08 65.66,5.08 64.64,4.06 61.34,4.06 59.31,6.1 57.18,6.1 U$3.14
  Bottom 0.305: CON1.112 v71.12,2.22
D18  (via drill 0.6)
  Top 0.406: v72.39,2.22 CON1.113
  Bottom 0.254: v72.39,2.22 72.39,4.95 72.26,5.08 71.75,5.08 71.25,4.57 69.72,4.57 68.71,5.59 65.41,5.59 64.9,5.08 64.77,4.95 64.52,4.7 61.47,4.7 59.69,6.48 59.69,7.87 58.93,8.64 58.04,8.64 56.98,9.7 U$3.15
  Bottom 0.305: CON1.113 v72.39,2.22
D19  (via drill 0.6)
  Top 0.406: v73.66,2.22 CON1.114
  Bottom 0.254: v73.66,2.22 73.66,4.7 72.77,5.59 71.5,5.59 70.99,5.08 69.85,5.08 68.83,6.1 65.15,6.1 64.39,5.33 61.59,5.33 60.2,6.73 60.2,8.16 U$3.17
  Bottom 0.305: CON1.114 v73.66,2.22
D20  (via drill 0.6)
  Top 0.406: v74.93,2.22 CON1.115
  Bottom 0.254: v74.93,2.22 74.93,5.21 74.04,6.1 71.25,6.1 70.74,5.59 70.23,5.59 69.22,6.6 64.9,6.6 64.13,5.84 62.52,5.84 U$3.18
  Bottom 0.305: CON1.115 v74.93,2.22
D21  (via drill 0.3 pad 0.25, 0.6)
  Top 0.254: v70.49,6.35 v70.49,7.75
  Top 0.406: v76.2,2.22 CON1.116
  Bottom 0.254: v76.2,2.22 76.2,4.7 74.3,6.6 70.74,6.6 v70.49,6.35 | v70.49,7.75 65.02,7.75 64.64,8.13 62.77,8.13 U$3.19
  Bottom 0.305: CON1.116 v76.2,2.22
D22  (via drill 0.6)
  Top 0.406: v77.47,2.22 CON1.117
  Bottom 0.254: v77.47,2.22 77.47,4.19 74.55,7.11 63.79,7.11 U$3.20
  Bottom 0.305: CON1.117 v77.47,2.22
D23  (via drill 0.6)
  Top 0.406: v78.74,2.22 CON1.118
  Bottom 0.254: v78.74,2.22 78.74,3.94 73.53,9.14 66.83,9.14 U$3.21
  Bottom 0.305: CON1.118 v78.74,2.22
D24  (via drill 0.6)
  Top 0.406: v80.01,2.22 CON1.119
  Bottom 0.254: U$4.13 75.8,8.4 77.34,6.86 77.34,6.1 78.49,4.95 79.88,4.95 80.01,4.83 v80.01,2.22
  Bottom 0.305: v80.01,2.22 CON1.119
D25  (via drill 0.6)
  Top 0.406: v81.28,2.22 CON1.120
  Bottom 0.254: v81.28,2.22 81.28,4.83 80.65,5.46 78.87,5.46 78.36,5.97 78.36,7.14 U$4.14
  Bottom 0.305: CON1.120 v81.28,2.22
D26  (via drill 0.6)
  Top 0.406: v82.55,2.22 CON1.121
  Bottom 0.254: v82.55,2.22 82.55,5.08 81.66,5.97 80.39,5.97 79.88,6.48 79.88,8.16 U$4.15
  Bottom 0.305: CON1.121 v82.55,2.22
D27  (via drill 0.6)
  Top 0.406: v83.82,2.22 CON1.122
  Bottom 0.254: v83.82,2.22 83.82,4.95 82.42,6.35 82.42,8.16 U$4.17
  Bottom 0.305: CON1.122 v83.82,2.22
D28  (via drill 0.6)
  Top 0.406: v85.09,2.22 CON1.123
  Bottom 0.254: v85.09,2.22 85.09,5.33 84.33,6.1 84.33,6.73 83.82,7.24 83.5,7.24 U$4.18
  Bottom 0.305: CON1.123 v85.09,2.22
D29  (via drill 0.6)
  Top 0.406: v86.36,2.22 CON1.124
  Bottom 0.254: v86.36,2.22 86.36,5.08 84.96,6.48 84.96,8.16 U$4.19
  Bottom 0.305: CON1.124 v86.36,2.22
D30  (via drill 0.6)
  Top 0.406: v87.63,2.22 CON1.125
  Bottom 0.254: U$4.20 86.69,7.16 87.63,6.22 v87.63,2.22
  Bottom 0.305: CON1.125 v87.63,2.22
D31  (via drill 0.6)
  Top 0.406: v88.9,2.22 CON1.126
  Bottom 0.254: v88.9,2.22 88.9,9.3 U$4.21
  Bottom 0.305: CON1.126 v88.9,2.22
GND  (via drill 0.3 pad 0.25, 0.6)  (3 unrouted)
  Top 0.254: U$1.16 15.19,7.16 15.49,6.86 15.49,6.35 17.78,4.06 v17.78,2.22 | U$4.16 81.36,7.16 82.42,6.1 91.19,6.1 | 91.19,6.1 91.44,5.84 91.44,2.03 | v36.43,3.81 36.43,3.57 36.7,3.3 43.05,3.3 43.18,3.17 v43.18,2.22 | 91.19,6.1 91.19,10.79 93.85,13.46 93.85,22.61 | 93.85,22.61 93.85,22.75 C3.2 | v92.33,22.61 93.85,22.61 | C4.2 47.6,23.27 v46.99,23.88 | v20.7,24.64 v18.03,24.64 | v15.37,24.64 9.02,24.64 v7.24,22.86 | v3.18,21.34 3.18,22.56 C1.2 | U$3.16 58.5,7.16 57.53,8.13 55.63,8.13 55.37,7.87 53.85,7.87 v53.21,7.24 | v72.52,24.13 72.52,23.62 72.26,23.37 71.25,23.37 71.25,23.14 C2.2
  Top 0.305: 43.18,2.52 v43.18,2.22
  Top 0.406: v91.44,2.22 91.44,2.03 CON1.128 | v17.78,2.22 CON1.74 | v43.18,2.22 CON1.94
  Bottom 0.254: v92.33,22.61 92.33,23.62 91.82,24.13 v72.52,24.13 | v46.99,23.88 46.99,24.26 46.61,24.64 36.96,24.64 36.7,24.38 32.89,24.38 32.64,24.64 v20.7,24.64 | v18.03,24.64 v15.37,24.64 | v7.24,22.86 4.7,22.86 v3.18,21.34 | v53.21,7.24 46.74,7.24 43.05,3.56 43.05,2.35 v43.18,2.22 | v36.43,3.81 U$2.16
  pour Top (isolate 0.406): 0.24,28.31 97.63,27.8 97.63,0.24 50.8,0.24 arc180 47.07,0.24 2.3,0.24 2.3,4.76 arc90 0.4,6.67 0.24,6.67
  pour Bottom (isolate 0.406): 0.24,28.31 97.63,27.8 97.63,0.24 50.8,0.24 arc180 47.07,0.24 2.3,0.24 2.3,4.76 arc90 0.4,6.67 0.24,6.67
N$1  (via drill 0.6)
  Top 0.406: CON1.110 v68.58,2.22
  Bottom 0.305: 68.45,2.46 68.5,2.41 CON1.110 v68.58,2.22
N$2  (via drill 0.6 pad 0.25)
  other vias: 7.62,2.29
N$3  (via drill 0.6 pad 0.25)
  other vias: 8.89,2.29
N$7  (via drill 0.6 pad 0.25)
  other vias: 67.31,2.29
N$8  (via drill 0.6 pad 0.25)
  other vias: 66.04,2.29
UNUSED3  (via drill 0.6)
  Top 0.406: v90.17,2.22 CON1.127
  Bottom 0.305: CON1.127 v90.17,2.22
VCC  (via drill 0.6)
  Top 0.305: C2.1 71.2,25.69 71.2,26.05 71.02,26.23 70.99,26.42
  Top 0.406: 6.48,1.65 CON1.65 v6.35,2.22 6.48,2.35 6.48,11.68 5.46,12.7 5.46,26.92 | C1.1 3.44,25.92 4.45,26.92 5.46,26.92 | 16.13,26.92 38.48,26.92 | 16.13,26.92 11.05,26.92 10.03,25.91 8.51,25.91 7.49,26.92 5.46,26.92 | 38.48,26.92 47.54,26.92 | 47.54,26.92 C4.1 | 60.33,26.92 47.54,26.92 | 60.33,26.92 70.49,26.92 | 70.49,26.92 70.99,26.42 | 82.68,26.92 70.49,26.92 | 82.68,26.92 87.5,26.92 88.27,26.16 91.82,26.16 92.58,26.92 93.34,26.92 93.85,26.42 93.85,25.57 C3.1 | U$4.32 83.42,26.18 82.68,26.92 | U$3.32 61.2,26.05 60.33,26.92 | U$2.32 38.97,26.43 38.48,26.92 | U$1.32 16.75,26.3 16.13,26.92
  Bottom 0.305: CON1.65 v6.35,2.22

### Text on the board
tPlace: DIP VER | © 2018 | ECONOSIM
bPlace: Francis Cap | Universal Mac Rom